# EAGLE design PPR_1_MP (EAGLE 6.4)

## Sheet 1 of 11
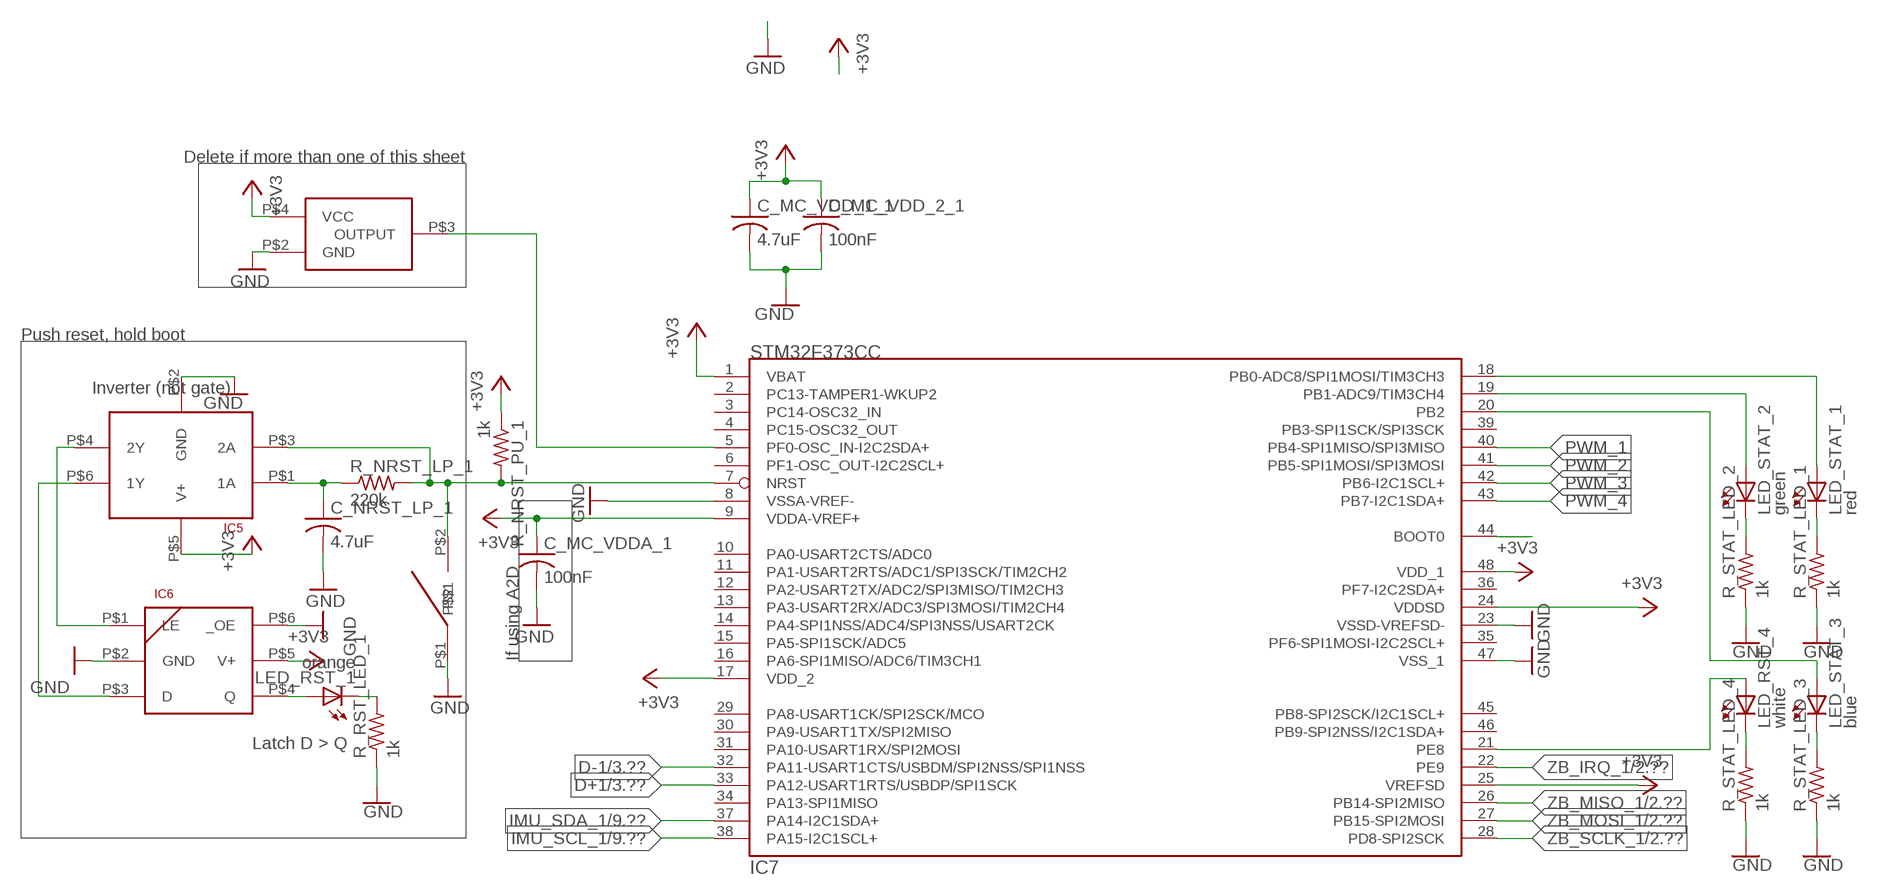
[diagram p0: schematic, sheet 1]

### Parts
C_MC_VDD_1_1  4.7uF  C-USC0402  [C0402]
C_MC_VDD_2_1  100nF  C-USC0402  [C0402]
C_MC_VDDA_1  100nF  C-USC0402  [C0402]
C_NRST_LP_1  4.7uF  C-USC0603K  [C0603K]
IC5  SN74LVC2G14DCKR  [DCK]
IC6  SN74LVC1G373DCKR  [DCK]
IC7  STM32F373CC  [LQFP48]
LED_RST_1  orange  LEDCHIPLED_0603  [CHIPLED_0603]
LED_RST_4  white  LEDCHIPLED_0603  [CHIPLED_0603]
LED_STAT_1  red  LEDCHIPLED_0603  [CHIPLED_0603]
LED_STAT_2  green  LEDCHIPLED_0603  [CHIPLED_0603]
LED_STAT_3  blue  LEDCHIPLED_0603  [CHIPLED_0603]
OSC1  FOX924B  [4-SMD_5X3.2]
R_NRST_LP_1  220k  R-US_R0402  [R0402]
R_NRST_PU_1  1k  R-US_R0402  [R0402]
R_RST_LED_1  1k  R-US_R0402  [R0402]
R_STAT_LED_1  1k  R-US_R0402  [R0402]
R_STAT_LED_2  1k  R-US_R0402  [R0402]
R_STAT_LED_3  1k  R-US_R0402  [R0402]
R_STAT_LED_4  1k  R-US_R0402  [R0402]
SW1  B3U  [B3U]

### Nets
16MHZ_3V3: IC7.5(PF0-OSC_IN-I2C2SDA+) OSC1.P$3(OUTPUT) ; also sheet 2
+3V3: C_MC_VDD_1_1.1 C_MC_VDD_2_1.1 C_MC_VDDA_1.1 IC5.P$5(V+) IC6.P$5(V+) IC7.1(VBAT) IC7.9(VDDA-VREF+) IC7.17(VDD_2) IC7.24(VDDSD) IC7.25(VREFSD) IC7.48(VDD_1) OSC1.P$4(VCC) R_NRST_PU_1.1 ; also sheet 2,8,9,10
BOOT0_1: IC5.P$6(1Y) IC6.P$3(D) IC7.44(BOOT0)
D+1: IC7.33(PA12-USART1RTS/USBDP/SPI1SCK) ; also sheet 3
D-1: IC7.32(PA11-USART1CTS/USBDM/SPI2NSS/SPI1NSS) ; also sheet 3
GND: C_MC_VDD_1_1.2 C_MC_VDD_2_1.2 C_MC_VDDA_1.2 C_NRST_LP_1.2 IC5.P$2(GND) IC6.P$2(GND) IC6.P$6(_OE) IC7.8(VSSA-VREF-) IC7.23(VSSD-VREFSD-) IC7.47(VSS_1) OSC1.P$2(GND) R_RST_LED_1.1 R_STAT_LED_1.1 R_STAT_LED_2.1 R_STAT_LED_3.1 R_STAT_LED_4.1 SW1.P$1 ; also sheet 2,3,4,5,6,7,8,9,10,11
IMU_SCL_1: IC7.38(PA15-I2C1SCL+) ; also sheet 9,10
IMU_SDA_1: IC7.37(PA14-I2C1SDA+) ; also sheet 9,10
LE_1: IC5.P$4(2Y) IC6.P$1(LE)
LED_RST_1_1: IC6.P$4(Q) LED_RST_1.A
LED_RST_2_1: LED_RST_1.C R_RST_LED_1.2
LED_RST_2_2: LED_STAT_1.C R_STAT_LED_1.2
LED_RST_2_3: LED_STAT_2.C R_STAT_LED_2.2
LED_RST_2_5: LED_RST_4.C R_STAT_LED_4.2
LED_STAT_2_3: LED_STAT_3.C R_STAT_LED_3.2
N$1: IC7.20(PB2) LED_STAT_3.A
N$2: IC7.18(PB0-ADC8/SPI1MOSI/TIM3CH3) LED_STAT_1.A
N$4: IC7.19(PB1-ADC9/TIM3CH4) LED_STAT_2.A
N$6: IC7.21(PE8) LED_RST_4.A
NRST_1: IC5.P$3(2A) IC7.7(NRST) R_NRST_LP_1.2 R_NRST_PU_1.2 SW1.P$2
NRST_LP_1: C_NRST_LP_1.1 IC5.P$1(1A) R_NRST_LP_1.1
PWM_1: IC7.40(PB4-SPI1MISO/SPI3MISO) ; also sheet 4
PWM_2: IC7.41(PB5-SPI1MOSI/SPI3MOSI) ; also sheet 5
PWM_3: IC7.42(PB6-I2C1SCL+) ; also sheet 6
PWM_4: IC7.43(PB7-I2C1SDA+) ; also sheet 7
ZB_IRQ_1: IC7.22(PE9) ; also sheet 2
ZB_MISO_1: IC7.26(PB14-SPI2MISO) ; also sheet 2
ZB_MOSI_1: IC7.27(PB15-SPI2MOSI) ; also sheet 2
ZB_SCLK_1: IC7.28(PD8-SPI2SCK) ; also sheet 2
Unconnected: IC7.2(PC13-TAMPER1-WKUP2) IC7.3(PC14-OSC32_IN) IC7.4(PC15-OSC32_OUT) IC7.6(PF1-OSC_OUT-I2C2SCL+) IC7.10(PA0-USART2CTS/ADC0) IC7.11(PA1-USART2RTS/ADC1/SPI3SCK/TIM2CH2) IC7.12(PA2-USART2TX/ADC2/SPI3MISO/TIM2CH3) IC7.13(PA3-USART2RX/ADC3/SPI3MOSI/TIM2CH4) IC7.14(PA4-SPI1NSS/ADC4/SPI3NSS/USART2CK) IC7.15(PA5-SPI1SCK/ADC5) IC7.16(PA6-SPI1MISO/ADC6/TIM3CH1) IC7.29(PA8-USART1CK/SPI2SCK/MCO) IC7.30(PA9-USART1TX/SPI2MISO) IC7.31(PA10-USART1RX/SPI2MOSI) IC7.34(PA13-SPI1MISO) IC7.35(PF6-SPI1MOSI-I2C2SCL+) IC7.36(PF7-I2C2SDA+) IC7.39(PB3-SPI1SCK/SPI3SCK) IC7.45(PB8-SPI2SCK/I2C1SCL+) IC7.46(PB9-SPI2NSS/I2C1SDA+)

### Notes on the sheet
- Delete if more than one of this sheet
- Push reset, hold boot
- Inverter (not gate)
- If using A2D
- Latch D > Q

## Sheet 2 of 11
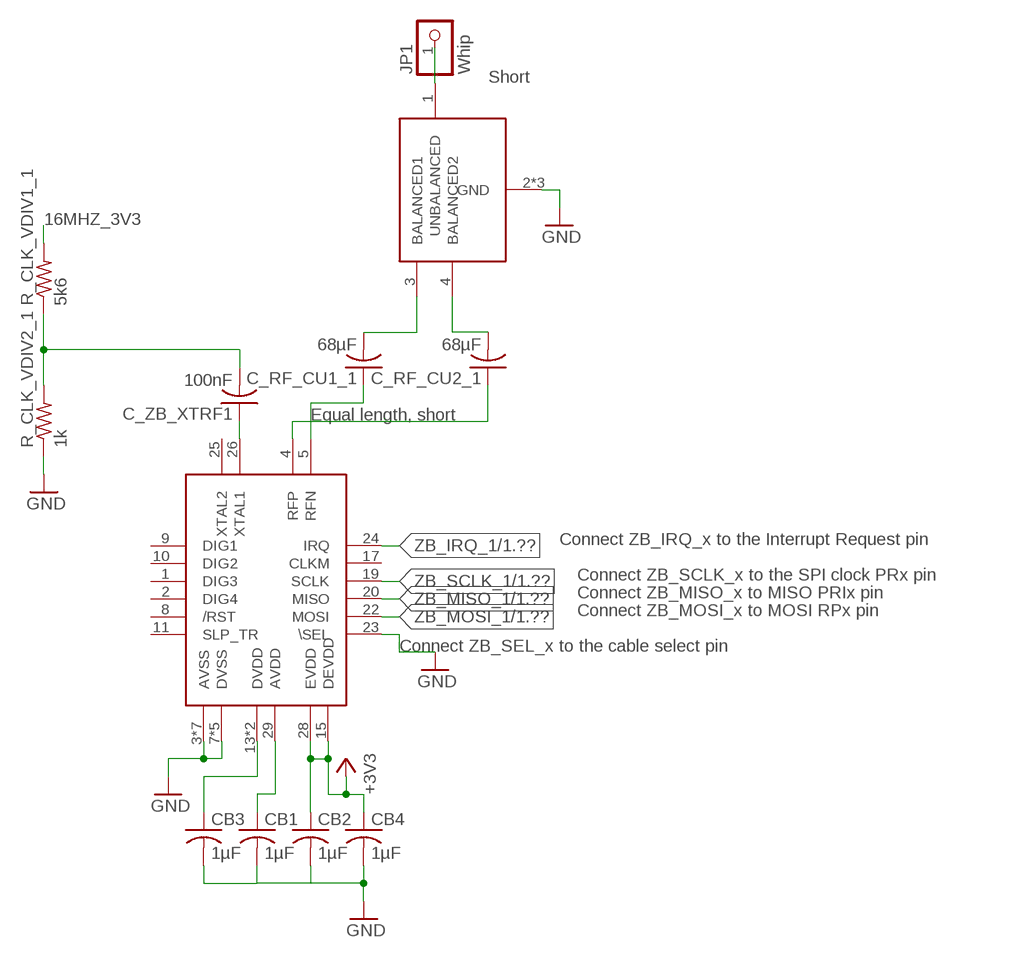
[diagram p1: schematic, sheet 2]

### Parts
BALUN1  0896FB15A0100  [0896FB15A0100]
C_RF_CU1_1  68µF  C-USC0603  [C0603]
C_RF_CU2_1  68µF  C-USC0603  [C0603]
C_ZB_XTRF1  100nF  C-USC0603  [C0603]
CB1  1µF  C-USC0603  [C0603]
CB2  1µF  C-USC0603  [C0603]
CB3  1µF  C-USC0603  [C0603]
CB4  1µF  C-USC0603  [C0603]
JP1  Whip  PINHD-1X01_2.00  [1X01M]
R_CLK_VDIV1_1  5k6  R-US_R0603  [R0603]
R_CLK_VDIV2_1  1k  R-US_R0603  [R0603]
RADIO1  AT86RF  [QFNN32]

### Nets
16MHZ_0V5_1: C_ZB_XTRF1.2 R_CLK_VDIV1_1.1 R_CLK_VDIV2_1.2
16MHZ_0V5_AC1: C_ZB_XTRF1.1 RADIO1.26(XTAL1)
16MHZ_3V3: R_CLK_VDIV1_1.2 ; also sheet 1
+3V3: CB2.1 CB4.1 RADIO1.15(DEVDD) RADIO1.28(EVDD) ; also sheet 1,8,9,10
ANT1: BALUN1.1(UNBALANCED) JP1.1
GND: BALUN1.2(GND) BALUN1.5(GND) BALUN1.6(GND) CB1.2 CB2.2 CB3.2 CB4.2 R_CLK_VDIV2_1.1 RADIO1.3(AVSS) RADIO1.6(AVSS) RADIO1.7(DVSS) RADIO1.12(DVSS) RADIO1.16(DVSS) RADIO1.18(DVSS) RADIO1.21(DVSS) RADIO1.23(\SEL) RADIO1.27(AVSS) RADIO1.30(AVSS) RADIO1.31(AVSS) RADIO1.32(AVSS) RADIO1.EXP(AVSS) ; also sheet 1,3,4,5,6,7,8,9,10,11
ZB_AVDD1: CB1.1 RADIO1.29(AVDD)
ZB_BAL1_1: BALUN1.3(BALANCED1) C_RF_CU1_1.2
ZB_BAL2_1: BALUN1.4(BALANCED2) C_RF_CU2_1.2
ZB_DVDD1: CB3.1 RADIO1.13(DVDD) RADIO1.14(DVDD)
ZB_IRQ_1: RADIO1.24(IRQ) ; also sheet 1
ZB_MISO_1: RADIO1.20(MISO) ; also sheet 1
ZB_MOSI_1: RADIO1.22(MOSI) ; also sheet 1
ZB_RFN1: C_RF_CU2_1.1 RADIO1.4(RFP)
ZB_RFP1: C_RF_CU1_1.1 RADIO1.5(RFN)
ZB_SCLK_1: RADIO1.19(SCLK) ; also sheet 1
Unconnected: RADIO1.1(DIG3) RADIO1.2(DIG4) RADIO1.8(/RST) RADIO1.9(DIG1) RADIO1.10(DIG2) RADIO1.11(SLP_TR) RADIO1.17(CLKM) RADIO1.25(XTAL2)

### Notes on the sheet
- Short
- Equal length, short
- Connect ZB_IRQ_x to the Interrupt Request pin
- Connect ZB_SCLK_x to the SPI clock PRx pin
- Connect ZB_MISO_x to MISO PRIx pin
- Connect ZB_MOSI_x to MOSI RPx pin
- Connect ZB_SEL_x to the cable select pin

## Sheet 3 of 11
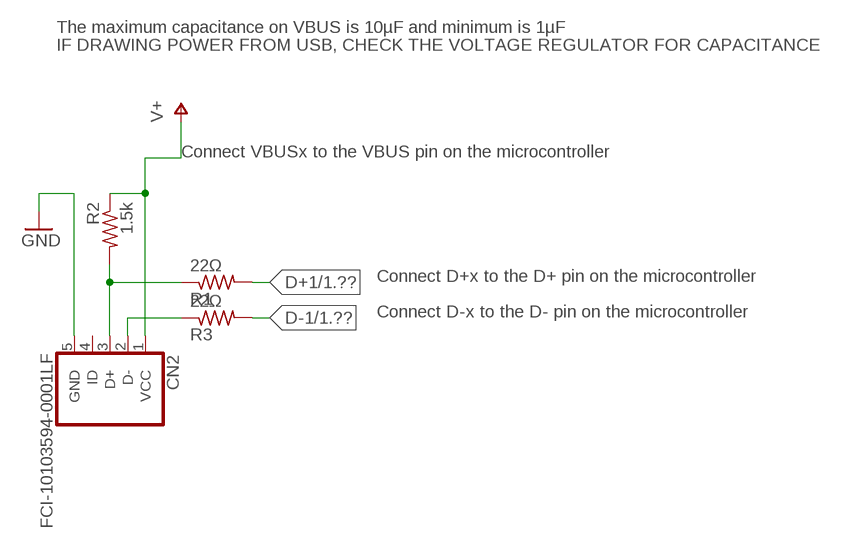
[diagram p2: schematic, sheet 3]

### Parts
CN2  FCI-10103594-0001LF  USB-RECEPTABLE  [FCI-10103594-0001LF]
R1  22Ω  R-US_R0402  [R0402]
R2  1.5k  R-US_R0402  [R0402]
R3  22Ω  R-US_R0402  [R0402]

### Nets
D+1: R1.2 ; also sheet 1
D+_IN_1: CN2.3(D+) R1.1 R2.2
D-1: R3.2 ; also sheet 1
D-_IN_1: CN2.2(D-) R3.1
GND: CN2.5(GND) ; also sheet 1,2,4,5,6,7,8,9,10,11
V+: CN2.1(VCC) R2.1 ; also sheet 4,5,6,7,8,11
Unconnected: CN2.4(ID)

### Notes on the sheet
- The maximum capacitance on VBUS is 10µF and minimum is 1µF
- IF DRAWING POWER FROM USB, CHECK THE VOLTAGE REGULATOR FOR CAPACITANCE
- Connect VBUSx to the VBUS pin on the microcontroller
- Connect D+x to the D+ pin on the microcontroller
- Connect D-x to the D- pin on the microcontroller

## Sheet 4 of 11
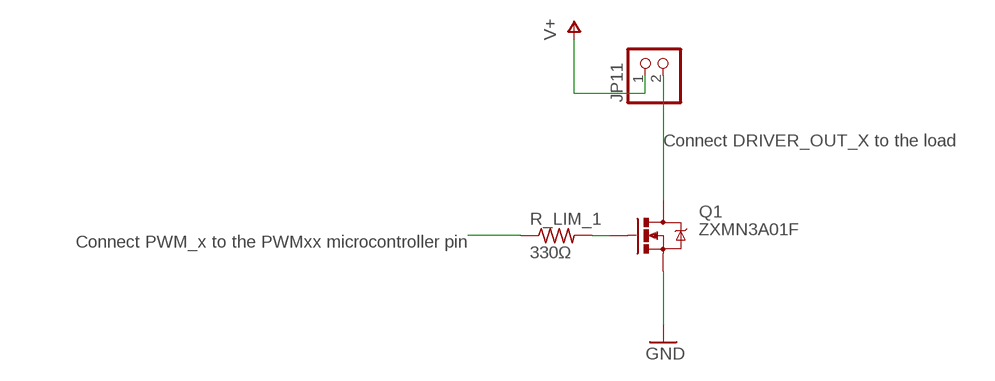
[diagram p3: schematic, sheet 4]

### Parts
JP11  PINHD-1X2  [1X02]
Q1  ZXMN3A01F  MOSFET-NCHANNELSMD  [SOT23-3]
R_LIM_1  330Ω  R-US_R0805  [R0805]

### Nets
DRIVER_OUT_1: JP11.2 Q1.3(D)
GATE_1: Q1.1(G) R_LIM_1.2
GND: Q1.2(S) ; also sheet 1,2,3,5,6,7,8,9,10,11
PWM_1: R_LIM_1.1 ; also sheet 1
V+: JP11.1 ; also sheet 3,5,6,7,8,11

### Notes on the sheet
- Connect DRIVER_OUT_X to the load
- Connect PWM_x to the PWMxx microcontroller pin

## Sheet 5 of 11
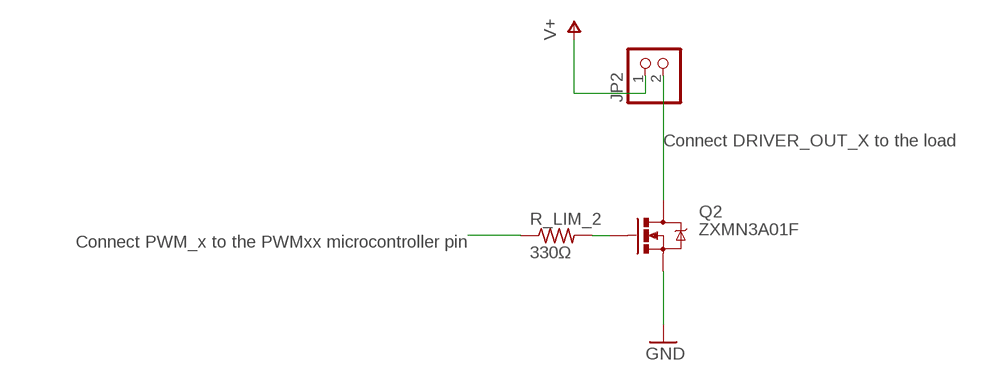
[diagram p4: schematic, sheet 5]

### Parts
JP2  PINHD-1X2  [1X02]
Q2  ZXMN3A01F  MOSFET-NCHANNELSMD  [SOT23-3]
R_LIM_2  330Ω  R-US_R0805  [R0805]

### Nets
DRIVER_OUT_2: JP2.2 Q2.3(D)
GATE_2: Q2.1(G) R_LIM_2.2
GND: Q2.2(S) ; also sheet 1,2,3,4,6,7,8,9,10,11
PWM_2: R_LIM_2.1 ; also sheet 1
V+: JP2.1 ; also sheet 3,4,6,7,8,11

### Notes on the sheet
- Connect DRIVER_OUT_X to the load
- Connect PWM_x to the PWMxx microcontroller pin

## Sheet 6 of 11
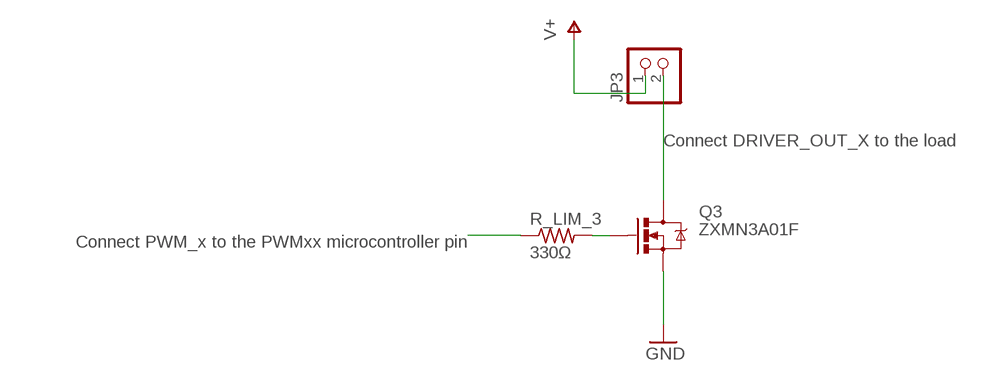
[diagram p5: schematic, sheet 6]

### Parts
JP3  PINHD-1X2  [1X02]
Q3  ZXMN3A01F  MOSFET-NCHANNELSMD  [SOT23-3]
R_LIM_3  330Ω  R-US_R0805  [R0805]

### Nets
DRIVER_OUT_3: JP3.2 Q3.3(D)
GATE_3: Q3.1(G) R_LIM_3.2
GND: Q3.2(S) ; also sheet 1,2,3,4,5,7,8,9,10,11
PWM_3: R_LIM_3.1 ; also sheet 1
V+: JP3.1 ; also sheet 3,4,5,7,8,11

### Notes on the sheet
- Connect DRIVER_OUT_X to the load
- Connect PWM_x to the PWMxx microcontroller pin

## Sheet 7 of 11
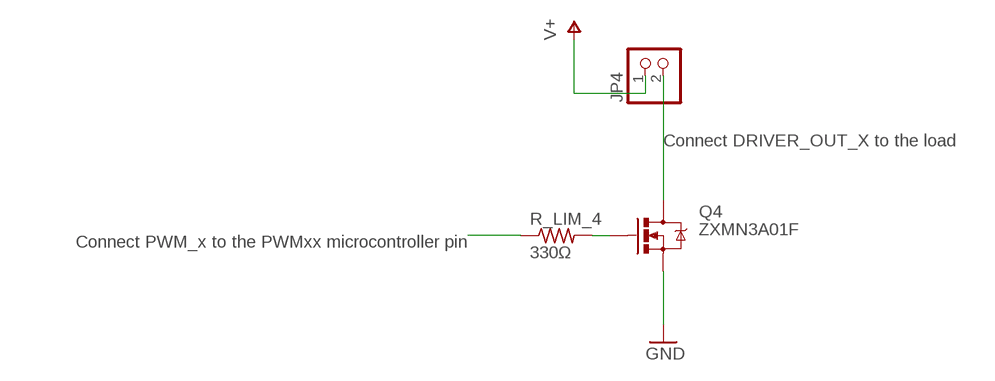
[diagram p6: schematic, sheet 7]

### Parts
JP4  PINHD-1X2  [1X02]
Q4  ZXMN3A01F  MOSFET-NCHANNELSMD  [SOT23-3]
R_LIM_4  330Ω  R-US_R0805  [R0805]

### Nets
DRIVER_OUT_4: JP4.2 Q4.3(D)
GATE_4: Q4.1(G) R_LIM_4.2
GND: Q4.2(S) ; also sheet 1,2,3,4,5,6,8,9,10,11
PWM_4: R_LIM_4.1 ; also sheet 1
V+: JP4.1 ; also sheet 3,4,5,6,8,11

### Notes on the sheet
- Connect DRIVER_OUT_X to the load
- Connect PWM_x to the PWMxx microcontroller pin

## Sheet 8 of 11
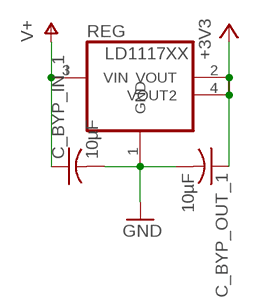
[diagram p7: schematic, sheet 8]

### Parts
C_BYP_IN_1  10µF  C-USC1206  [C1206]
C_BYP_OUT_1  10µF  C-USC0603  [C0603]
REG  LD1117XX  [SOT-223]

### Nets
+3V3: C_BYP_OUT_1.1 REG.2(VOUT) REG.4(VOUT2) ; also sheet 1,2,9,10
GND: C_BYP_IN_1.2 C_BYP_OUT_1.2 REG.1(GND) ; also sheet 1,2,3,4,5,6,7,9,10,11
V+: C_BYP_IN_1.1 REG.3(VIN) ; also sheet 3,4,5,6,7,11

## Sheet 9 of 11
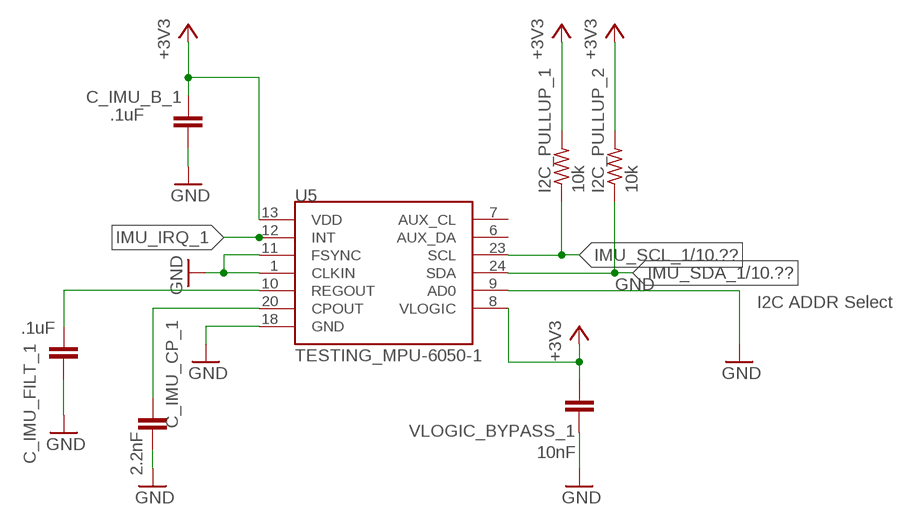
[diagram p8: schematic, sheet 9]

### Parts
C_IMU_B_1  .1uF  CAP0402-CAP  [0402-CAP]
C_IMU_CP_1  2.2nF  CAP0402-CAP  [0402-CAP]
C_IMU_FILT_1  .1uF  CAP0402-CAP  [0402-CAP]
I2C_PULLUP_1  10k  R-US_R0402  [R0402]
I2C_PULLUP_2  10k  R-US_R0402  [R0402]
U5  TESTING_MPU-6050-1  [TESTING_QFN-24-4MM2]
VLOGIC_BYPASS_1  10nF  CAP0402-CAP  [0402-CAP]

### Nets
+3V3: C_IMU_B_1.2 I2C_PULLUP_1.2 I2C_PULLUP_2.2 U5.8(VLOGIC) U5.13(VDD) VLOGIC_BYPASS_1.2 ; also sheet 1,2,8,10
CPOUT_1: C_IMU_CP_1.2 U5.20(CPOUT)
GND: C_IMU_B_1.1 C_IMU_CP_1.1 C_IMU_FILT_1.1 U5.1(CLKIN) U5.9(AD0) U5.11(FSYNC) U5.18(GND) VLOGIC_BYPASS_1.1 ; also sheet 1,2,3,4,5,6,7,8,10,11
IMU_IRQ_1: U5.12(INT)
IMU_SCL_1: I2C_PULLUP_1.1 U5.23(SCL) ; also sheet 1,10
IMU_SDA_1: I2C_PULLUP_2.1 U5.24(SDA) ; also sheet 1,10
REGOUT_1: C_IMU_FILT_1.2 U5.10(REGOUT)
Unconnected: U5.6(AUX_DA) U5.7(AUX_CL)

### Notes on the sheet
- I2C ADDR Select

## Sheet 10 of 11
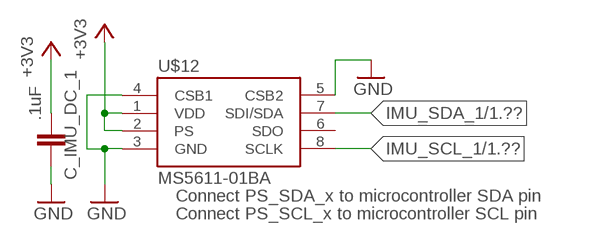
[diagram p9: schematic, sheet 10]

### Parts
C_IMU_DC_1  .1uF  CAP0402-CAP  [0402-CAP]
U$12  MS5611-01BA  [MS5611-01BA]

### Nets
+3V3: C_IMU_DC_1.2 U$12.1(VDD) U$12.2(PS) ; also sheet 1,2,8,9
GND: C_IMU_DC_1.1 U$12.3(GND) U$12.4(CSB1) U$12.5(CSB2) ; also sheet 1,2,3,4,5,6,7,8,9,11
IMU_SCL_1: U$12.8(SCLK) ; also sheet 1,9
IMU_SDA_1: U$12.7(SDI/SDA) ; also sheet 1,9
Unconnected: U$12.6(SDO)

### Notes on the sheet
- Connect PS_SDA_x to microcontroller SDA pin
- Connect PS_SCL_x to microcontroller SCL pin

## Sheet 11 of 11
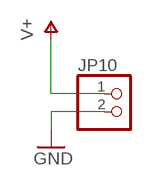
[diagram p10: schematic, sheet 11]

### Parts
JP10  PINHD-1X2  [1X02]

### Nets
GND: JP10.2 ; also sheet 1,2,3,4,5,6,7,8,9,10
V+: JP10.1 ; also sheet 3,4,5,6,7,8

## Library data of the parts
BALUN1 = piccoli:0896FB15A0100
C_BYP_IN_1 C_BYP_OUT_1 C_MC_VDD_1_1 C_MC_VDD_2_1 C_MC_VDDA_1 C_NRST_LP_1 C_RF_CU1_1 C_RF_CU2_1 C_ZB_XTRF1 CB1-CB4 = resistor:C-US: CAPACITOR, American symbol
C_IMU_B_1 C_IMU_CP_1 C_IMU_DC_1 C_IMU_FILT_1 VLOGIC_BYPASS_1 = SparkFun:CAP: Capacitor Standard 0603 ceramic capacitor, and 0.1" leaded capacitor.
CN2 = neels:USB-RECEPTABLE: USB Receptable
I2C_PULLUP_1 I2C_PULLUP_2 R_LIM_1-R_LIM_4 = rcl:R-US_: RESISTOR, American symbol
IC5 = neels:SN74LVC2G14DCKR
IC6 = neels:SN74LVC1G373DCKR
IC7 = neels:STM32F373CC
JP1 = pinhead-2:PINHD-1X01: PIN HEADER
JP2-JP4 JP10 JP11 = pinhead:PINHD-1X2: PIN HEADER
LED_RST_1 LED_RST_4 LED_STAT_1-LED_STAT_3 = led:LED: LED OSRAM: - CHIPLED LG R971, LG N971, LY N971, LG Q971, LY Q971, LO R971, LY R971 LH N974, LH R974 LS Q976, LO Q976, LY Q976 LO Q996 - Hyper CHIPLED LW Q18S LB Q993, LB Q99A, LB R99A - SideLED LS A670, LO A670, LY A670, LG A670, LP A670 LB A673, LV A673, LT A673, LW A673 LH A674 LY A675 LS A676, LA A676, LO A676, LY A676, LW A676 LS A679, LY A679, LG A679 - Hyper Micro SIDELED® LS Y876, LA Y876, LO Y876, LY Y876 LT Y87S - SmartLED LW L88C, LW L88S LB L89C, LB L89S, LG L890 LS L89K, LO L89K, LY L89K LS L896, LA L896, LO L896, LY L896 - TOPLED LS T670, LO T670, LY T670, LG T670, LP T670 LSG T670, LSP T670, LSY T670, LOP T670, LYG T670 LG T671, LOG T671, LSG T671 LB T673, LV T673, LT T673, LW T673 LH T674 LS T676, LA T676, LO T676, LY T676, LB T676, LH T676, LSB T676, LW T676 LB T67C, LV T67C, LT T67C, LS T67K, LO T67K, LY T67K, LW E67C LS E67B, LA E67B, LO E67B, LY E67B, LB E67C, LV E67C, LT E67C LW T67C LS T679, LY T679, LG T679 LS T770, LO T770, LY T770, LG T770, LP T770 LB T773, LV T773, LT T773, LW T773 LH T774 LS E675, LA E675, LY E675, LS T675 LS T776, LA T776, LO T776, LY T776, LB T776 LHGB T686 LT T68C, LB T68C - Hyper Mini TOPLED® LB M676 - Mini TOPLED Santana® LG M470 LS M47K, LO M47K, LY M47K Source: http://www.osram.convergy.de LUXEON: - LUMILED® LXK2-PW12-R00, LXK2-PW12-S00, LXK2-PW14-U00, LXK2-PW14-V00 LXK2-PM12-R00, LXK2-PM12-S00, LXK2-PM14-U00 LXK2-PE12-Q00, LXK2-PE12-R00, LXK2-PE12-S00, LXK2-PE14-T00, LXK2-PE14-U00 LXK2-PB12-K00, LXK2-PB12-L00, LXK2-PB12-M00, LXK2-PB14-N00, LXK2-PB14-P00, LXK2-PB14-Q00 LXK2-PR12-L00, LXK2-PR12-M00, LXK2-PR14-Q00, LXK2-PR14-R00 LXK2-PD12-Q00, LXK2-PD12-R00, LXK2-PD12-S00 LXK2-PH12-R00, LXK2-PH12-S00 LXK2-PL12-P00, LXK2-PL12-Q00, LXK2-PL12-R00 Source: www.luxeon.com KINGBRIGHT: KA-3528ASYC Source: www.kingbright.com
OSC1 = piccoli:FOX924B
Q1-Q4 = SparkFun-DiscreteSemi:MOSFET-NCHANNEL: Generic NMOS footprint
R1-R3 R_CLK_VDIV1_1 R_CLK_VDIV2_1 R_NRST_LP_1 R_NRST_PU_1 R_RST_LED_1 R_STAT_LED_1-R_STAT_LED_4 = resistor:R-US_: RESISTOR, American symbol
RADIO1 = piccoli:AT86RF
REG = piccoli:LD1117XX
SW1 = zz-upenn:B3U
U5 = MPU-6050:TESTING_MPU-6050: MPU-6050 6DOF IMU
U$12 = 3DRobotics:MS5611-01BA: MS5611-01BA The MS5611-01BA is a new generation of high resolution altimeter sensors from MEAS Switzerland with SPI and I 2 C bus interface. It is optimized for altimeters and variometers with an altitude resolution of 10 cm. The sensor module includes a high linearity pressure sensor and an ultra low power 24 bit ?? ADC with internal factory calibrated coefficients. It provides a precise digital 24 Bit pressure and temperature value and different operation modes that allow the user to optimize for conversion speed and current consumption. A high resolution temperature output allows the implementation of an altimeter/thermometer function without any additional sensor. The MS5611-01BA can be interfaced to virtually any microcontroller. The communication protocol is simple, without the need of programming internal registers in the device. Small dimensions of only 5.0 mm x 3.0 mm and a height of 1.7 mm allow for integration in mobile devices. This new sensor module generation is based on leading MEMS technology and latest benefits from MEAS Switzerland proven experience and know-how in high volume manufacturing of altimeter modules, which have been widely used for over a decade. The sensing principle employed leads to very low hysteresis and high stability of both pressure and temperature signal. High resolution module, 10 cm Fast conversion down to 1 ms Low power, 1 µA (standby < 0.15 µA) QFN package 5.0 x 3.0 x 1.7 mm3 Supply voltage 1.8 to 3.6 V Integrated digital pressure sensor (24 bit ?? ADC) Operating range: 10 to 1200 mbar, -40 to +85 °C I2C and SPI interface up to 20 MHz No external components (Internal oscillator) Excellent long term stability; DATASHEET: http://www.meas-spec.com/downloads/MS5611-01BA01.pdf; LINK: http://www.meas-spec.com/product/t_product.aspx?id=8503#; MFGPN: MS5611-01BA

## Board
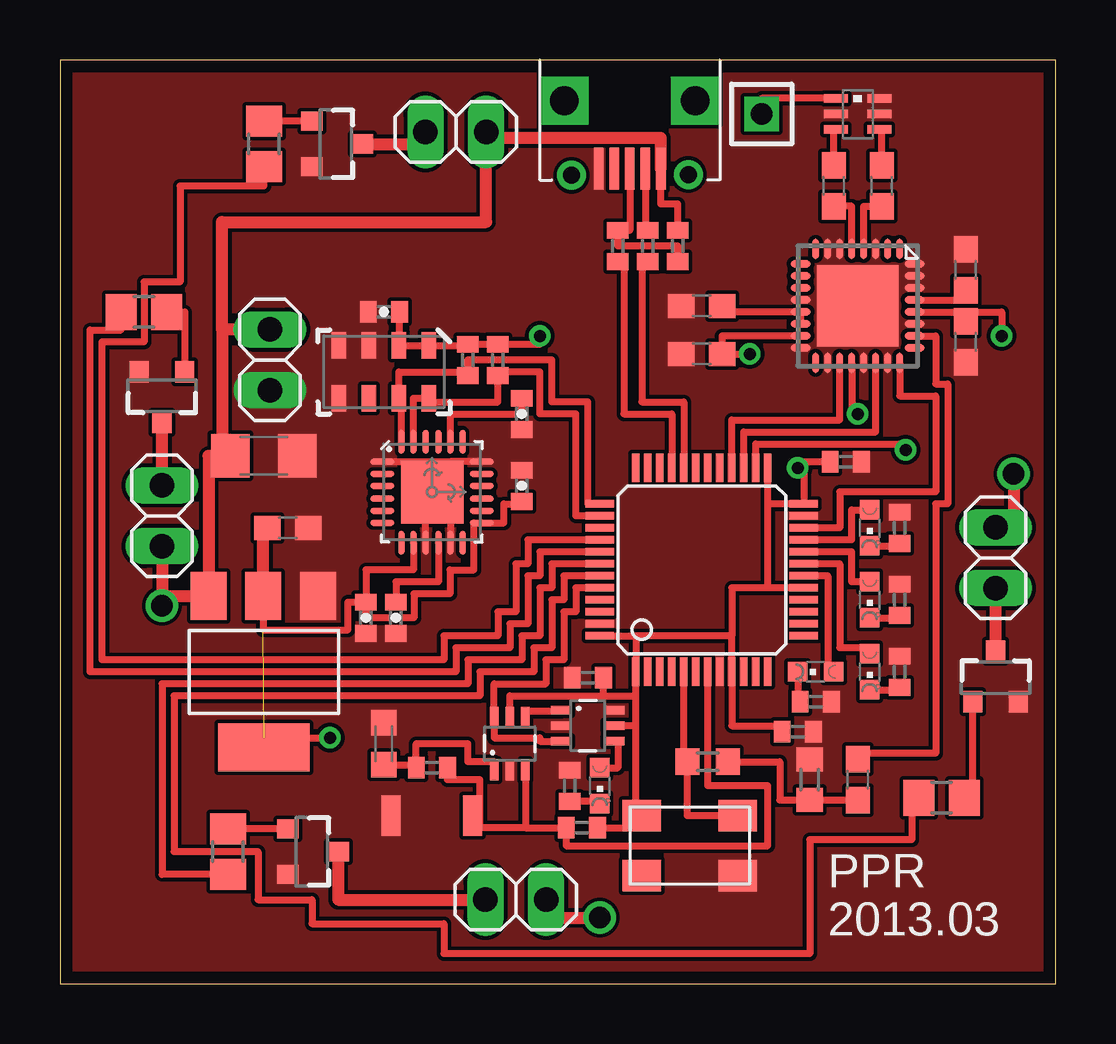
[diagram p11: board, top side]
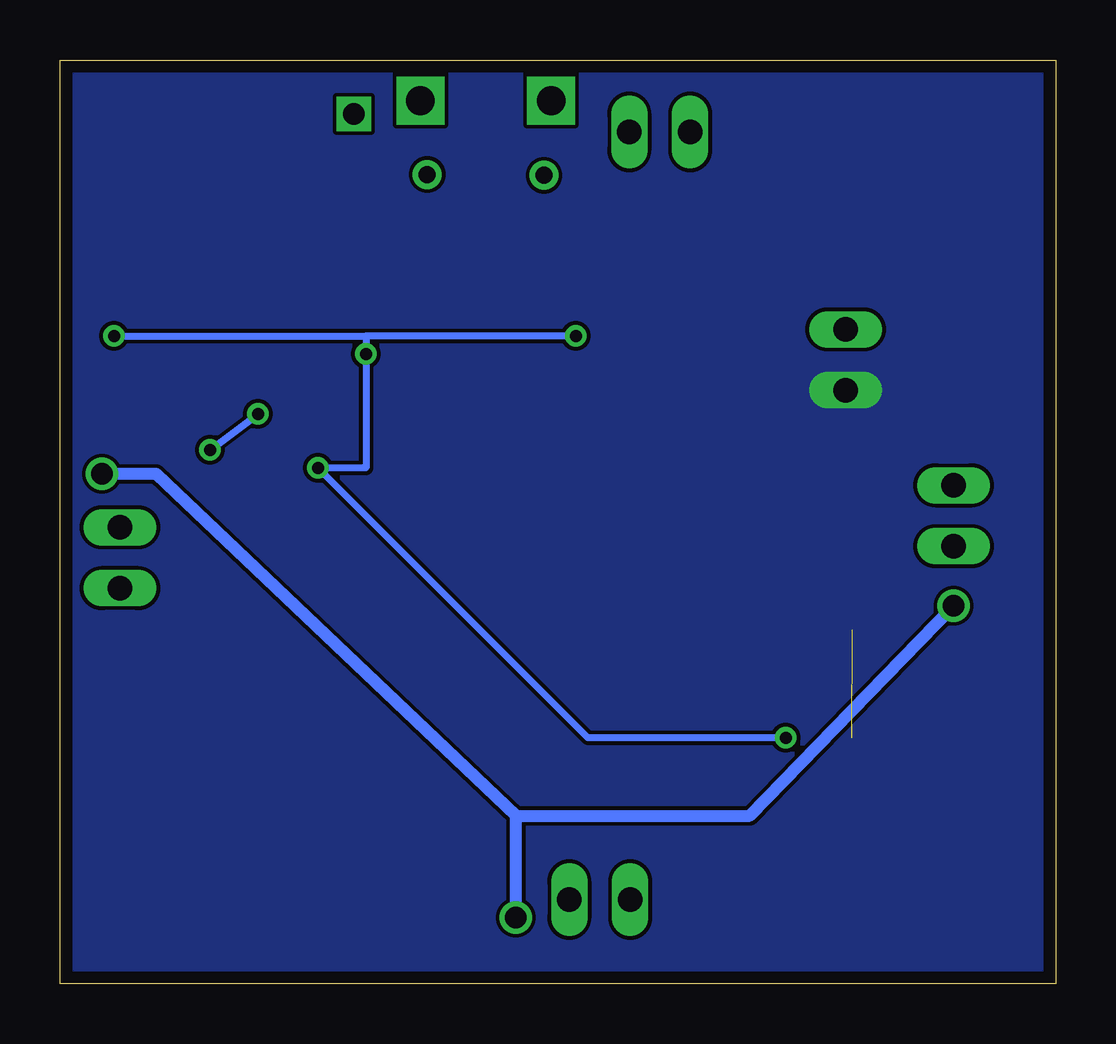
[diagram p12: board, bottom side, seen from below]

Size 41.5 x 38.5 mm. Coordinates in mm from the lower left corner, seen from the top.
Outline: 0,0 41.5,0 41.5,38.5 0,38.5 0,0
Copper layers (1*16): Top 0.035mm / dielectric 1.5mm / Bottom 0.035mm
Design rules "4pcb 33 each": minimum track width 6mil, minimum drill 15mil, track to track 6mil, track to pad 6mil, pad to pad 6mil, via to via 6mil, smd to smd 3mil, copper to edge 20mil, drill to drill 8mil, minimum pad ring 10mil, minimum via ring 8mil, stop-mask expansion 4mil, vias tented up to drill 0mil, thermal gap 10mil

### Footprints (pad centres in the part's own frame; a part is rotated, then mirrored left to right if it is on the bottom)
0896FB15A0100 = smd 0.35 x 1: 1 -0.65,-0.9; 2 0,-0.9; 3 0.65,-0.9; 4 0.65,0.9; 5 0,0.9; 6 -0.65,0.9
C1206 = smd 1.6 x 1.8: 1 -1.4,0; 2 1.4,0
C0603 = smd 1.1 x 1: 1 -0.85,0; 2 0.85,0
0402-CAP = smd 0.7 x 0.9: 1 -0.65,0; 2 0.65,0
C0402 = smd 0.7 x 0.9: 1 -0.65,0; 2 0.65,0
C0603K = smd 1.05 x 1.08: 1 -0.875,0; 2 0.875,0
FCI-10103594-0001LF = smd 0.4 x 1.75: 1 -1.3,4.525; 2 -0.65,4.525; 3 0,4.525; 4 0.65,4.525; 5 1.3,4.525 | drill 0.7: P$1 -2.443,4.776; P$2 2.428,4.806 | drill 1.2 pad 2 square: P$3 -2.725,1.7; P$4 2.725,1.7
R0402 = smd 0.7 x 0.9: 1 -0.65,0; 2 0.65,0
DCK = smd 0.35 x 0.85: P$1 -0.65,-1.1; P$2 0,-1.1; P$3 0.65,-1.1; P$4 0.65,1.1; P$5 0,1.1; P$6 -0.65,1.1
LQFP48 = smd 0.3 x 1.2: 1 -2.75,-4.25; 2 -2.25,-4.25; 3 -1.75,-4.25; 4 -1.25,-4.25; 5 -0.75,-4.25; 6 -0.25,-4.25; 7 0.25,-4.25; 8 0.75,-4.25; 9 1.25,-4.25; 10 1.75,-4.25; 11 2.25,-4.25; 12 2.75,-4.25; 25 2.75,4.25; 26 2.25,4.25; 27 1.75,4.25; 28 1.25,4.25; 29 0.75,4.25; 30 0.25,4.25; 31 -0.25,4.25; 32 -0.75,4.25; 33 -1.25,4.25; 34 -1.75,4.25; 35 -2.25,4.25; 36 -2.75,4.25 | smd 1.2 x 0.3: 13 4.25,-2.75; 14 4.25,-2.25; 15 4.25,-1.75; 16 4.25,-1.25; 17 4.25,-0.75; 18 4.25,-0.25; 19 4.25,0.25; 20 4.25,0.75; 21 4.25,1.25; 22 4.25,1.75; 23 4.25,2.25; 24 4.25,2.75; 37 -4.25,2.75; 38 -4.25,2.25; 39 -4.25,1.75; 40 -4.25,1.25; 41 -4.25,0.75; 42 -4.25,0.25; 43 -4.25,-0.25; 44 -4.25,-0.75; 45 -4.25,-1.25; 46 -4.25,-1.75; 47 -4.25,-2.25; 48 -4.25,-2.75
1X01M = drill 0.914 square: 1 0,0
1X02 = drill 1.016 long: 1 -1.27,0; 2 1.27,0
CHIPLED_0603 = smd 0.8 x 0.8: A 0,-0.75; C 0,0.75
4-SMD_5X3.2 = smd 1.6 x 1.3: P$1 -2,-1.25; P$2 2,-1.25; P$3 2,1.25; P$4 -2,1.25
SOT23-3 = smd 0.8 x 0.9: 1 -0.95,-1; 2 0.95,-1; 3 0,1.1
R0603 = smd 1 x 1.1: 1 -0.85,0; 2 0.85,0
R0805 = smd 1.3 x 1.5: 1 -0.95,0; 2 0.95,0
QFNN32 = smd 0.85 x 0.3: 1 -2.375,1.75; 2 -2.375,1.25; 3 -2.375,0.75; 4 -2.375,0.25; 5 -2.375,-0.25; 6 -2.375,-0.75; 7 -2.375,-1.25; 8 -2.375,-1.75; 17 2.375,-1.75; 18 2.375,-1.25; 19 2.375,-0.75; 20 2.375,-0.25; 21 2.375,0.25; 22 2.375,0.75; 23 2.375,1.25; 24 2.375,1.75 | smd 0.3 x 0.85: 9 -1.75,-2.375; 10 -1.25,-2.375; 11 -0.75,-2.375; 12 -0.25,-2.375; 13 0.25,-2.375; 14 0.75,-2.375; 15 1.25,-2.375; 16 1.75,-2.375; 25 1.75,2.375; 26 1.25,2.375; 27 0.75,2.375; 28 0.25,2.375; 29 -0.25,2.375; 30 -0.75,2.375; 31 -1.25,2.375; 32 -1.75,2.375 | smd 3.4 x 3.4: EXP 0,0
SOT-223 = smd 1.499 x 2.007: 1 -2.261,-3.15; 2 0.025,-3.15; 3 2.311,-3.15 | smd 3.81 x 2.007: 4 0,3.15
B3U = smd 0.8 x 1.7: P$1 -1.7,0; P$2 1.7,0
TESTING_QFN-24-4MM2 = smd 1.016 x 0.254: 1 -2.066,1.257; 2 -2.066,0.75; 3 -2.066,0.247; 4 -2.066,-0.287; 5 -2.066,-0.792; 6 -2.066,-1.297; 13 2.086,-1.297; 14 2.086,-0.792; 15 2.086,-0.287; 16 2.086,0.247; 17 2.086,0.75; 18 2.086,1.257 | smd 0.254 x 1.016: 7 -1.267,-2.122; 8 -0.762,-2.122; 9 -0.258,-2.122; 10 0.278,-2.122; 11 0.78,-2.122; 12 1.287,-2.122; 19 1.287,2.082; 20 0.78,2.082; 21 0.278,2.082; 22 -0.258,2.082; 23 -0.762,2.082; 24 -1.267,2.082 | smd 2.616 x 2.616: P$1 0.02,-0.01
MS5611-01BA = smd 1.1 x 0.6: 1 -1.1,1.875; 2 -1.1,0.625; 3 -1.1,-0.625; 4 -1.1,-1.875; 5 1.1,-1.875; 6 1.1,-0.625; 7 1.1,0.625; 8 1.1,1.875

### Placement (x,y rotation side)
BALUN1  33.25,36.25 270 top
C_BYP_IN_1  8.5,22 0 top
C_BYP_OUT_1  9.5,19 0 top
C_IMU_B_1  19.25,20.75 270 top
C_IMU_CP_1  19.25,23.75 90 top
C_IMU_DC_1  13.5,28 0 top
C_IMU_FILT_1  14,15.25 90 top
C_MC_VDD_1_1  22,12.75 180 top
C_MC_VDD_2_1  32.75,21.75 0 top
C_MC_VDDA_1  30.75,10.5 0 top
C_NRST_LP_1  13.5,10 90 top
C_RF_CU1_1  32.25,33.25 90 top
C_RF_CU2_1  34.25,33.25 90 top
C_ZB_XTRF1  33.25,8.5 270 top
CB1  37.75,29.75 90 top
CB2  37.75,26.75 270 top
CB3  26.75,28.25 180 top
CB4  26.75,26.25 180 top
CN2  23.75,38.5 180 top
I2C_PULLUP_1  18.25,26 90 top
I2C_PULLUP_2  17,26 90 top
IC5  18.75,10 0 top
IC6  22,10.75 270 top
IC7  26.75,17.25 0 top
JP1  29.25,36.25 270 top
JP2  4.25,19.5 90 top
JP3  19,3.5 180 top
JP4  39,17.75 270 top
JP10  8.75,26 270 top
JP11  16.5,35.5 180 top
LED_RST_1  22.5,8.25 180 top
LED_RST_4  33.75,19 180 top
LED_STAT_1  31.5,13 90 top
LED_STAT_2  33.75,13 180 top
LED_STAT_3  33.75,16 180 top
OSC1  26.25,5.75 0 top
Q1  11.5,35 270 top
Q2  4.25,24.5 180 top
Q3  10.5,5.5 270 top
Q4  39,12.75 0 top
R1  23.25,30.75 270 top
R2  25.75,30.75 270 top
R3  24.5,30.75 270 top
R_CLK_VDIV1_1  27,9.25 180 top
R_CLK_VDIV2_1  31.25,8.5 270 top
R_LIM_1  8.5,35 90 top
R_LIM_2  3.5,28 0 top
R_LIM_3  7,5.5 90 top
R_LIM_4  36.75,7.75 0 top
R_NRST_LP_1  15.5,9 0 top
R_NRST_PU_1  21.75,6.5 180 top
R_RST_LED_1  21.25,8.25 270 top
R_STAT_LED_1  31.5,11.75 180 top
R_STAT_LED_2  35,13 270 top
R_STAT_LED_3  35,16 270 top
R_STAT_LED_4  35,19 270 top
RADIO1  33.25,28.25 270 top
REG  8.5,13 180 top
SW1  15.5,7 0 top
U5  15.5,20.5 0 top
U$12  13.5,25.5 270 top
VLOGIC_BYPASS_1  12.75,15.25 90 top

### Tracks (layer width: path | path; a pad name or v marks a point on that pad's centre or on a via)
16MHZ_0V5_1
  Top 0.3: R_CLK_VDIV1_1.1 30,9.25 30,7.65 R_CLK_VDIV2_1.2 C_ZB_XTRF1.2
16MHZ_0V5_AC1
  Top 0.3: RADIO1.26 36.5,27 36.5,25 37,25 37,20 36.5,20 36.5,9.6 33.25,9.6 C_ZB_XTRF1.1
16MHZ_3V3
  Top 0.3: OSC1.P$3 26.15,7 R_CLK_VDIV1_1.2 26,9.25 IC7.5
+3V3  (via drill 0.5)  (1 unrouted)
  Top 0.3: 24,10.75 24,7 OSC1.P$4 24.25,6.5 R_NRST_PU_1.1 | 24,10.75 IC6.P$5 | C_IMU_DC_1.2 14.12,28 U$12.2 U$12.1 17.25,26.6 I2C_PULLUP_2.2 I2C_PULLUP_1.2 20,26.65 v20,27 | IC7.48 24,14.5 | 24,14.5 IC7.1 24,12 | 29.5,20 IC7.24 31,21.5 | 29.5,20 IC7.25 | 28,14.5 IC7.9 28,10.75 30.1,10.75 C_MC_VDDA_1.1 | 28,14.5 24,14.5 | 28,14.5 28,16.5 IC7.17 29.5,16.5 29.5,20 | 24,10.75 24,12 | C_IMU_B_1.2 19.25,20 18.5,20 18.5,19.2 U5.13 17.25,19.2 17.25,17.25 16.25,17.25 16.25,16.25 14.75,16.25 14.75,15.25 12.75,15.25 VLOGIC_BYPASS_1.2 | C_MC_VDD_2_1.1 31,21.75 31,21.5 | IC5.P$5 18.75,12 22.65,12 | 22.65,12 C_MC_VDD_1_1.1 | 22.65,12 24,12 | U5.8 14.74,17.25 12.75,17.25 VLOGIC_BYPASS_1.2 | REG.2 8.47,14.75 12,14.75 12,15.9 VLOGIC_BYPASS_1.2 | v30.75,21.5 31,21.5 | REG.4 8.5,10.25 v11.25,10.25 | RADIO1.15 27.6,27 CB4.1 v28.75,26.25 | CB2.1 37.75,28 RADIO1.28 39.25,28 v39.25,27
  Top 0.5: REG.2 8.47,19 C_BYP_OUT_1.1
  Bottom 0.3: v11.25,10.25 19.5,10.25 v30.75,21.5 28.75,21.5 v28.75,26.25 28.75,27 | v39.25,27 28.75,27 | v20,27 28.75,27
ANT1
  Top 0.3: BALUN1.1 29.25,36.9 JP1.1
BOOT0_1
  Top 0.3: IC6.P$3 20,10.1 20,10.25 18.1,10.25 IC5.P$6 18.1,12.5 20.25,12.5 20.25,13.5 21,13.5 21,15.5 21.5,15.5 21.5,16.5 IC7.44
CPOUT_1
  Top 0.3: U5.20 16.28,23.75 19.25,23.75 C_IMU_CP_1.2
D+1
  Top 0.3: IC7.33 25.5,23.75 23.5,23.75 23.5,30.1 R1.2
D+_IN_1
  Top 0.3: CN2.3 23.75,31.4 R1.1 23.25,30.75 25.75,30.75 R2.2
D-1
  Top 0.3: R3.2 24.25,30.1 24.25,24.25 26,24.25 IC7.32
D-_IN_1
  Top 0.3: CN2.2 24.4,31.4 R3.1
DRIVER_OUT_1
  Top 0.5: Q1.3 15.23,35 JP11.2
DRIVER_OUT_2
  Top 0.5: JP2.2 Q2.3
DRIVER_OUT_3
  Top 0.5: Q3.3 11.6,3.5 JP3.2
DRIVER_OUT_4
  Top 0.5: Q4.3 JP4.2
GATE_1
  Top 0.3: Q1.1 R_LIM_1.2
GATE_2
  Top 0.3: R_LIM_2.2 5.2,28 Q2.1
GATE_3
  Top 0.3: 9.55,6.45 Q3.1 R_LIM_3.2
GATE_4
  Top 0.3: R_LIM_4.2 38.05,8.25 Q4.1
GND
  Top 0.3: IC6.P$2 20.75,10.75 | 15.24,18.5 15.24,21.5 16.27,21.5 | 16.27,21.5 16.27,18.5 | U5.18 16.27,21.76 | 16.27,21.76 16.27,21.5 | 13.5,21.76 16.27,21.76 | 16.27,21.76 16.5,21.75
  pour Top (no thermals): 0,0 41.5,0 41.5,38.5 0,38.5
  pour Bottom (no thermals): 0,38.5 41.5,38.5 41.5,0 0,0
IMU_SCL_1
  Top 0.3: U5.23 14.74,24.4 U$12.8 15.38,24.25 18.25,24.25 I2C_PULLUP_1.1 18.25,25.5 20,25.5 20,23.75 21.5,23.75 21.5,19.5 IC7.38
IMU_SDA_1
  Top 0.3: U5.24 14.23,24.4 U$12.7 14.12,25.5 17.25,25.5 I2C_PULLUP_2.1 17,26 20.5,26 20.5,24.25 22,24.25 22,20 IC7.37
LE_1
  Top 0.3: IC6.P$1 20.9,11.35 19.4,11.35 IC5.P$4
LED_RST_1_1
  Top 0.3: 23,10.1 IC6.P$4 23.25,10.1 23.25,9 LED_RST_1.A 22.25,9
LED_RST_2_1
  Top 0.3: LED_RST_1.C 22.5,7.6 R_RST_LED_1.2
LED_RST_2_2
  Top 0.3: LED_STAT_1.C 30.75,11.75 R_STAT_LED_1.2
LED_RST_2_3
  Top 0.3: LED_STAT_2.C 35,12.25 R_STAT_LED_2.2
LED_RST_2_5
  Top 0.3: LED_RST_4.C 35,18.25 R_STAT_LED_4.2
LED_STAT_2_3
  Top 0.3: LED_STAT_3.C 35,15.25 R_STAT_LED_3.2
N$1
  Top 0.3: LED_STAT_3.A 33,16.75 33,18 IC7.20
N$2
  Top 0.3: LED_STAT_1.A 32,13 32,17 IC7.18
N$4
  Top 0.3: IC7.19 32.5,17.5 32.5,14 33.75,14 LED_STAT_2.A
N$6
  Top 0.3: LED_RST_4.A 33,19.75 33,18.5 IC7.21
NRST_1
  Top 0.3: IC7.7 27,8.25 29.5,8.25 29.5,5.75 21.1,5.75 R_NRST_PU_1.2 19.4,6.5 | IC5.P$3 19.4,6.5 | 19.4,6.5 17.5,6.5 | SW1.P$2 17.2,6.5 17.5,6.5 | 17.5,6.5 17.5,8.5 16.15,8.5 R_NRST_LP_1.2
NRST_LP_1
  Top 0.3: 18.1,9 IC5.P$1 18.1,9.25 17,9.25 17,10 14.85,10 R_NRST_LP_1.1 14.85,9.12 C_NRST_LP_1.1
PWM_1
  Top 0.3: IC7.40 19.5,18.5 19.5,17.5 19,17.5 19,15.5 18.25,15.5 18.25,14.5 16,14.5 16,13.5 1.75,13.5 1.75,26.75 3.5,26.75 3.5,29.25 5,29.25 5,33.25 8.5,33.25 R_LIM_1.1
PWM_2
  Top 0.3: IC7.41 20,18 20,17 19.5,17 19.5,15 18.75,15 18.75,14 16.5,14 16.5,13 1.25,13 1.25,27.25 2.55,27.25 R_LIM_2.1
PWM_3
  Top 0.3: IC7.42 20.5,17.5 20.5,16.5 20,16.5 20,14.5 19.25,14.5 19.25,13.5 17,13.5 17,12.5 4.25,12.5 4.25,4.55 R_LIM_3.1
PWM_4
  Top 0.3: IC7.43 21,17 21,16 20.5,16 20.5,14 19.75,14 19.75,13 17.5,13 17.5,12 4.75,12 4.75,5.5 8.25,5.5 8.25,3.5 10.5,3.5 10.5,2.5 16,2.5 16,1.25 31.25,1.25 31.25,6 35.5,6 35.5,8 35.3,8 R_LIM_4.1
REGOUT_1
  Top 0.3: U5.10 15.78,16.75 14,16.75 C_IMU_FILT_1.2
V+  (via drill 0.9)
  Top 0.3: R2.1 25.75,32.5 25.05,32.5 CN2.1
  Top 0.4: 17.77,35.25 JP11.1
  Top 0.5: 6.75,22 6.19,22 REG.3 4.25,16.15 | 6.75,27.27 6.75,22 | 6.75,22 C_BYP_IN_1.1 | JP2.1 4.25,16.15 | JP3.1 20.27,2.75 v22.5,2.75 | v4.25,15.75 4.25,16.15 | v39.75,21.25 39.75,19.02 JP4.1 | JP10.1 6.75,27.27 | 6.75,27.27 6.75,31.75 17.77,31.75 JP11.1 | CN2.1 25.05,35.25 17.77,35.25
  Bottom 0.5: v22.5,2.75 22.5,7 | 22.5,7 37.5,21.25 v39.75,21.25 | 22.5,7 12.75,7 v4.25,15.75
ZB_AVDD1
  Top 0.3: RADIO1.29 37.4,28.5 CB1.1
ZB_BAL1_1
  Top 0.3: C_RF_CU1_1.2 32.25,35.6 BALUN1.3
ZB_BAL2_1
  Top 0.3: C_RF_CU2_1.2 34.25,35.6 BALUN1.4
ZB_DVDD1
  Top 0.3: RADIO1.14 RADIO1.13 27.75,28 27.75,28.25 CB3.1
ZB_IRQ_1
  Top 0.3: RADIO1.24 35,24.5 36.5,24.5 36.5,20.5 32.5,20.5 32.5,19 IC7.22
ZB_MISO_1  (via drill 0.5)
  Top 0.3: IC7.26 29,22.5 35.25,22.5 v35.25,22.25 | RADIO1.20 33,23.75 v33.25,23.75
  Bottom 0.3: v35.25,22.25 v33.25,23.75
ZB_MOSI_1
  Top 0.3: IC7.27 28.5,23 34,23 RADIO1.22
ZB_RFN1
  Top 0.3: RADIO1.4 33.5,32.4 C_RF_CU2_1.1
ZB_RFP1
  Top 0.3: RADIO1.5 33,32.4 C_RF_CU1_1.1
ZB_SCLK_1
  Top 0.3: IC7.28 28,23.5 32.5,23.5 RADIO1.19

### Text on the board
tPlace: PPR | 2013.03